# Altium schematic sheet DC075B_DTGC_CPLD.SchDoc: DTGC CPLD
size 558 x 431 mm; Date: Not shown in title block; ApprovedBy: Not shown in title block; CheckedBy: Not shown in title block; Author: Not shown in title block; CompanyName: Not shown in title block; DrawnBy: Praveen Aroul; Engineer: Not shown in title block; Organization: Not shown in title block; Address1: Not shown in title block; Address2: Not shown in title block; Address3: Not shown in title block; Address4: Not shown in title block; DocumentNumber: 9; Revision: Use project parameter SCH_Rev; SheetNumber: 9; SheetTotal: 13; PageSetup: Record=PageOptions|CenterHorizontal=True|CenterVertical=True|PrintScale=1.00|XCorrection=1.00|YCorrection=1.00|PrintKind=0|BorderSize=5000000|LeftOffset=0|BottomOffset=0|Orientation=2|PaperLength=1000|PaperWidth=1000|Scale=100|PaperSource=15|PrintQuality=600|MediaType=1|DitherType=10|PaperKind=Letter|PrintScaleMode=1; CurrentTime: Not shown in title block; CurrentDate: Not shown in title block; Time: Not shown in title block; DocumentFullPathAndName: Not shown in title block; DocumentName: Not shown in title block; ModifiedDate: Not shown in title block; ImagePath: Not shown in title block
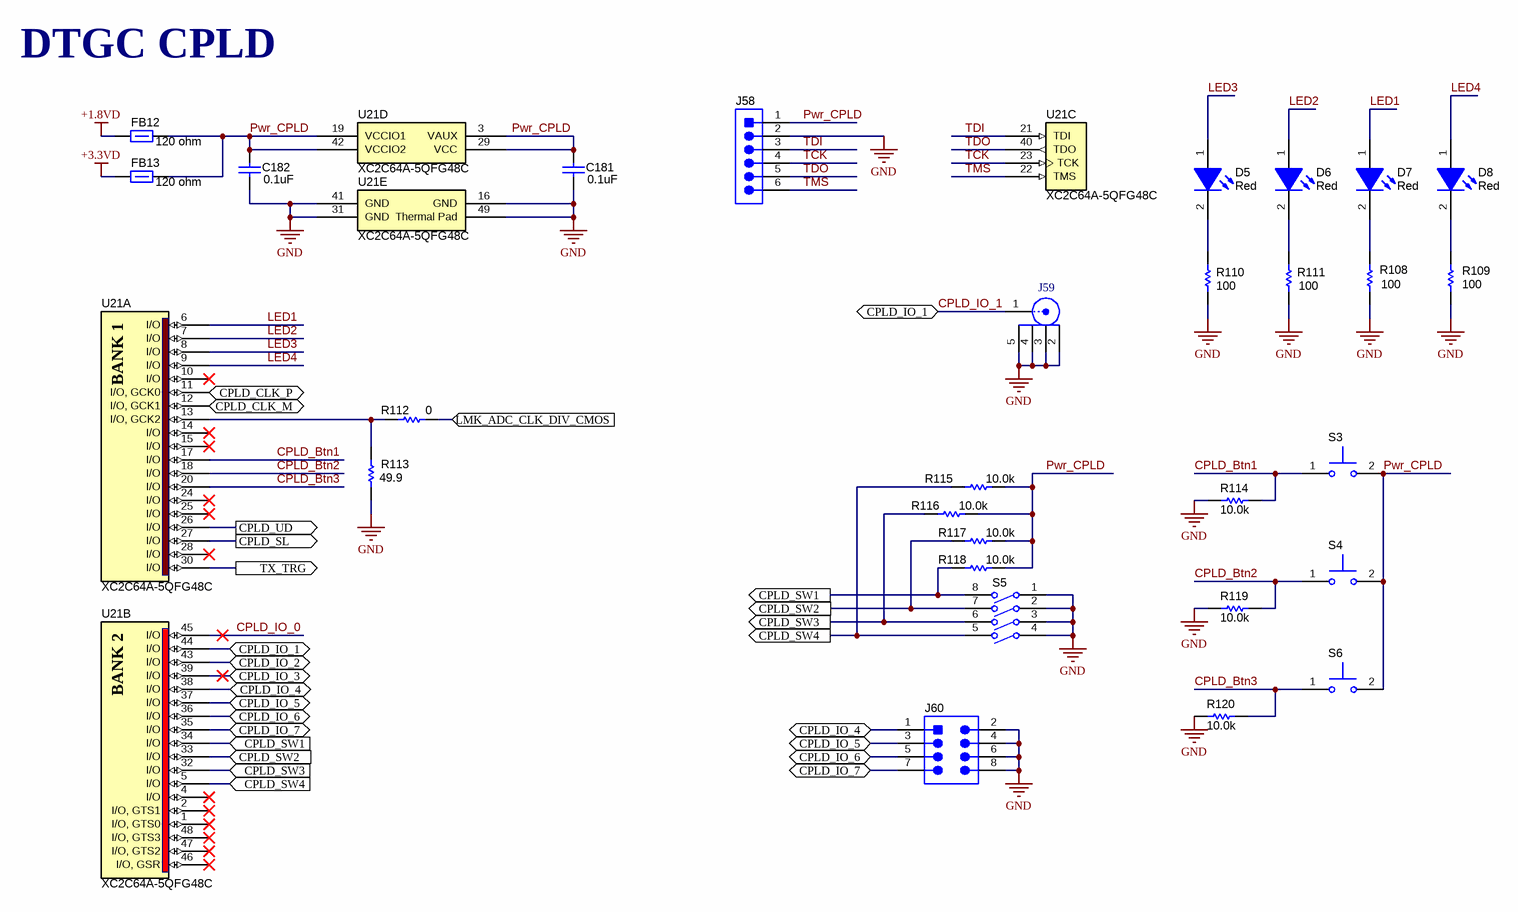
[diagram p0: DC075B_DTGC_CPLD.SchDoc]

## Parts
C181  value 0.1uF  [0603]  (hidden comment: CL10A104KA8NNNC)
C182  value 0.1uF  [0603]  (hidden comment: CL10A104KA8NNNC)
D5  value Red  [LED_LTST-C190_Red]  (hidden comment: LTST-C190CKT)
D6  value Red  [LED_LTST-C190_Red]  (hidden comment: LTST-C190CKT)
D7  value Red  [LED_LTST-C190_Red]  (hidden comment: LTST-C190CKT)
D8  value Red  [LED_LTST-C190_Red]  (hidden comment: LTST-C190CKT)
FB12  value 120 ohm  [0805]  (hidden comment: Ferrite_Bead)
FB13  value 120 ohm  [0805]  (hidden comment: Ferrite_Bead)
J58  Header_6x1  [TSW-106-07-G-S]  (value not drawn)
J59  5-1814832-1  [TE_5-1814832-1]  (value not drawn)
J60  Header_4x2  [TSW-104-07-G-D]  (value not drawn)
R108  ValueDisplayed: 100  [0402]  (hidden comment: Resistor)
R109  ValueDisplayed: 100  [0402]  (hidden comment: Resistor)
R110  ValueDisplayed: 100  [0402]  (hidden comment: Resistor)
R111  ValueDisplayed: 100  [0402]  (hidden comment: Resistor)
R112  value 0  [0402]  (hidden comment: Resistor)
R113  value 49.9  [0402]  (hidden comment: Resistor)
R114  value 10.0k  [0603]  (hidden comment: Resistor)
R115  value 10.0k  [0603]  (hidden comment: Resistor)
R116  value 10.0k  [0603]  (hidden comment: Resistor)
R117  value 10.0k  [0603]  (hidden comment: Resistor)
R118  value 10.0k  [0603]  (hidden comment: Resistor)
R119  value 10.0k  [0603]  (hidden comment: Resistor)
R120  value 10.0k  [0603]  (hidden comment: Resistor)
S3  SKRKAEE020  [SW_SKRKAE]  (value not drawn)
S4  SKRKAEE020  [SW_SKRKAE]  (value not drawn)
S5  SW_4SPST  [SW_1571983-5]  (value not drawn)
S6  SKRKAEE020  [SW_SKRKAE]  (value not drawn)
U21  XC2C64A-5QFG48C  [QFG48_N]  (parts A,B,C,D,E of 5)

## Ports
CPLD_CLK_M (out), CPLD_CLK_P (out), CPLD_IO_1, CPLD_IO_2, CPLD_IO_3, CPLD_IO_4 (bidir), CPLD_IO_5, CPLD_IO_6, CPLD_IO_7, CPLD_SL (out), CPLD_SW1 (in), CPLD_SW1 (out), CPLD_SW2 (in), CPLD_SW2 (out), CPLD_SW3 (in), CPLD_SW3 (out), CPLD_SW4 (in), CPLD_SW4 (out), CPLD_UD (out), LMK_ADC_CLK_DIV_CMOS (in), TX_TRG (out)

## Nets
+1.8VD: FB12.2
+3.3VD: FB13.2
GND: C181.2 C182.2 J58.2 J59.2 J59.3 J59.4 J59.5 J60.2 J60.4 J60.6 J60.8 R108.1 R109.1 R110.1 R111.1 R113.2 R114.2 R119.2 R120.2 S5.1(A1) S5.2(A2) S5.3(A3) S5.4(A4) U21.16(GND) U21.31(GND) U21.41(GND) U21.49(Thermal_Pad)
CPLD_Btn1: R114.1 S3.1 U21.17(I/O)
CPLD_Btn2: R119.1 S4.1 U21.18(I/O)
CPLD_Btn3: R120.1 S6.1 U21.20(I/O)
CPLD_CLK_M: U21.12(I/O,_GCK1) ; port CPLD_CLK_M
CPLD_CLK_P: U21.11(I/O,_GCK0) ; port CPLD_CLK_P
CPLD_IO_0: U21.45(I/O)
CPLD_IO_1: J59.1 U21.44(I/O) ; port CPLD_IO_1
CPLD_IO_2: U21.43(I/O) ; port CPLD_IO_2
CPLD_IO_3: U21.39(I/O) ; port CPLD_IO_3
CPLD_IO_4: J60.1 U21.38(I/O) ; port CPLD_IO_4
CPLD_IO_5: J60.3 U21.37(I/O) ; port CPLD_IO_5
CPLD_IO_6: J60.5 U21.36(I/O) ; port CPLD_IO_6
CPLD_IO_7: J60.7 U21.35(I/O) ; port CPLD_IO_7
CPLD_SL: U21.27(I/O) ; port CPLD_SL
CPLD_SW1: R118.1 S5.8(B1) U21.34(I/O) ; port CPLD_SW1
CPLD_SW2: R117.1 S5.7(B2) U21.33(I/O) ; port CPLD_SW2
CPLD_SW3: R116.1 S5.6(B3) U21.32(I/O) ; port CPLD_SW3
CPLD_SW4: R115.1 S5.5(B4) U21.5(I/O) ; port CPLD_SW4
CPLD_UD: U21.26(I/O) ; port CPLD_UD
LED1: D7.1(A) U21.6(I/O)
LED2: D6.1(A) U21.7(I/O)
LED3: D5.1(A) U21.8(I/O)
LED4: D8.1(A) U21.9(I/O)
LMK_ADC_CLK_DIV_CMOS: R112.1 ; port LMK_ADC_CLK_DIV_CMOS
Pwr_CPLD: C181.1 C182.1 FB12.1 FB13.1 J58.1 R115.2 R116.2 R117.2 R118.2 S3.2 S4.2 S6.2 U21.3(VAUX) U21.19(VCCIO1) U21.29(VCC) U21.42(VCCIO2)
TCK: J58.4 U21.23(TCK)
TDI: J58.3 U21.21(TDI)
TDO: J58.5 U21.40(TDO)
TMS: J58.6 U21.22(TMS)
TX_TRG: U21.30(I/O) ; port TX_TRG
NetD5_2: D5.2(K) R110.2
NetD6_2: D6.2(K) R111.2
NetD7_2: D7.2(K) R108.2
NetD8_2: D8.2(K) R109.2
NetR112_2: R112.2 R113.1 U21.13(I/O,_GCK2)

Not connected (* = marked no-connect by the designer): U21 1(I/O,_GTS0)* 2(I/O,_GTS1)* 4(I/O)* 10(I/O)* 14(I/O)* 15(I/O)* 24(I/O)* 25(I/O)* 28(I/O)* 46(I/O,_GSR)* 47(I/O,_GTS2)* 48(I/O,_GTS3)*

## Notes on the sheet
- DTGC CPLD
- Drawn By:
- SVN Rev:
- Number:
- TID #:
- Orderable:
- Rev:
- Sheet Title:
- File:
- Project Title:
- Designed for:
- Assembly Variant:
- Mod. Date:
- Sheet:
- Size:
- of
- C
- http://www.ti.com
- Texas Instruments and/or its licensors do not warrant the accuracy or completeness of this specification or any information contained therein. Texas Instruments and/or its licensors do not warrant that this design will meet the specifications, will be suitable for your application or fit for any particular purpose, or will operate in an implementation. Texas Instruments and/or its licensors do not warrant that the design is production worthy. You should completely validate and test your design implementation to confirm the system functionality for your application.
- Engineer:
- Contact:
- © Texas Instruments
- (in symbol CMP-0005395-2, part A) BANK 1
- (in symbol CMP-0005395-2, part B) BANK 2

## Library data of the parts
C181 C182 = CMP-0085577-2: CAP, CERM, 0.1 µF, 25 V,+/- 10%, X5R, 0603; Manufacturer: Samsung Electro-Mechanics; Polarized: N; ValueDisplayed: 0.1µF; U/M: EA; Cap_F: 100nF; VDC_V: 25V; TaMin_C: -55°C; TaMax_C: 85°C; AEC Category: Q200; SizeArea_mm2: 1.28; SizeAreaWB_mm2: 4.68; SizeX_mm: 1.6; SizeY_mm: 0.8; SizeZ_mm: 1; Green_REACh: Incomplete; Green_Lifecycle: Active; CompType: Capacitor; PartNumber: CL10A104KA8NNNC; PackageReference: 0603; RoHS: Y; Tolerance_%: 10%; Value2: 25V; MountType: SMT; Technology: Ceramic; TempCo: X5R; Cap_Case: 0603; ComponentLink1Description: Datasheet link; ComponentLink1URL: http://www.samsungsem.com/kr/support/product-search/mlcc/__icsFiles/afieldfile/2018/06/20/CL10A104KA8NNNC.pdf; AEC Grade: N/A; AEC Qualified: N; Green_EU RoHS: Passed; Green_EU RoHS-2: Incomplete
D5-D8 = CMP-0002842-2: LED, Red, SMD; Manufacturer: Lite-On; Vf_V: 2V; Io_A: 20mA; Tjmax_C: 85°C; Power_TotalModule: 62.5mW; Value1: 0.0625W; CompType: LED; MountType: SMT; ComponentLink1URL: http://optoelectronics.liteon.com/en-us/api/DwonloadFileHandler.ashx?txtSpecNo=DS-22-98-0009&txtPartNo=LTST-C190CKT; ComponentLink1Description: Datasheet link; PackageReference: Red LED, 1.6x0.8x0.8mm; PartNumber: LTST-C190CKT; RoHS: Y; Type: ?; Value2: 2V; Color: red
FB12 FB13 = CMP-0003358-1: Ferrite Bead, 120 ohm @ 100 MHz, 0.8 A, 0805; Manufacturer: MuRata; PartNumber: BLM21AG121SN1D; Imax_A: 8dA; DCR_ohm: 1d; Value1: 0.1 ohm; Value2: 0.8A; ZTyp@100MHz_Ohm: 120; SizeArea_mm2: 2.5; SizeAreaWB_mm2: 6.75; SizeX_mm: 2; SizeY_mm: 1.25; SizeZ_mm: 1.45; ComponentLink1Description: Datasheet link; ComponentLink1URL: http://search.murata.co.jp/Ceramy/image/img/PDF/ENG/L0110S0100BLM21A.pdf; CompType: Ferrite Bead; MountType: SMT; PackageReference: 0805; RoHS: Y; Published: 2014-04-30; Publisher: Texas Instruments; LatestRevisionDate: 2017-03-09; Supplier 1: Digi-Key; Supplier Part Number 1: 490-1038-1-ND; Supplier 2: Newark; Supplier Part Number 2: 73M9128; Supplier 3: Mouser; Supplier Part Number 3: 81-BLM21AG121SN1D; ValueDisplayed: 120 ohm
J58 = CMP-0075413-2: Header, 100mil, 6x1, Gold, TH; Manufacturer: Samtec; Cert_CSA: Y; Cert_CULUS: N; Current_A: 6.3A; Gender: Male; Green_Lifecycle: Active; Green_REACh: Passed; Pitch_mm: 2.54; Row_Count: 1; Voltage_V: 550V; PartNumber: TSW-106-07-G-S; PackageReference: 6x1 Header; ClassName: Header; CompType: Header; RoHS: Y; MountType: TH; ComponentLink1Description: Datasheet URL; ComponentLink1URL: http://samtec.com/ftppub/pdf/TSW_TH.PDF; Supplier 1: Digi-Key; Supplier Part Number 1: SAM1029-06-ND; Cert_UL: Y; Cert_VDE: N; Color: Black; ContactFinish: Gold; Green_EU RoHS-2: Passed; Green_EU RoHS: Passed; Orientation: Vertical; PinCount: 6; Shrouded: N
J59 = CMP-0054990-1: SMA Straight PCB Socket Die Cast, 50 Ohm, TH; Manufacturer: TE Connectivity; Green_Lifecycle: Active; Green_REACh: Passed; CNHeader: FALSE; CT: TRUE; PartNumber: 5-1814832-1; PackageReference: SMA Straight PCB Socket Die Cast, TH; CompType: SMA; RoHS: Y; MountType: TH; ComponentLink1Description: Datasheet URL; ComponentLink1URL: http://www.te.com/commerce/DocumentDelivery/DDEController?Action=srchrtrv&DocNm=1814832&DocType=Customer+Drawing&DocLang=English; Supplier 1: Digi-Key; Supplier Part Number 1: A97594-ND; Supplier 2: Newark; Supplier Part Number 2: 78M7270; Supplier 3: Mouser; Supplier Part Number 3: 571-5-1814832-1; Green_EU RoHS-2: Incomplete; Green_EU RoHS: Passed with Exemption; Publisher: Texas Instruments; LatestRevisionDate: 26/05/2017
J60 = CMP-0075408-2: Header, 100mil, 4x2, Gold, TH; Manufacturer: Samtec; Cert_CSA: Y; Cert_CULUS: N; Current_A: 6.3A; Gender: Male; Green_Lifecycle: Active; Green_REACh: Passed; Pitch_mm: 2.54; Row_Count: 2; Voltage_V: 550V; PartNumber: TSW-104-07-G-D; PackageReference: 4x2 Header; ClassName: Header; CompType: Header; RoHS: Y; MountType: TH; ComponentLink1Description: Datasheet URL; ComponentLink1URL: http://samtec.com/ftppub/pdf/TSW_TH.PDF; Supplier 1: Digi-Key; Supplier Part Number 1: SAM1028-04-ND; Cert_UL: Y; Cert_VDE: N; Color: Black; ContactFinish: Gold; Green_EU RoHS-2: Passed; Green_EU RoHS: Passed; Orientation: Vertical; PinCount: 8; RowSpacing_mm: 2.54; Shrouded: N
R108-R111 = CMP-0026656-1: RES, 100, 1%, 0.1 W, 0402; Manufacturer: Panasonic; PartNumber: ERJ-2RKF1000X; Value: 100; Value_Code: 100R; Power_W: 100mW; Value2: 0.1W; VDC_V: 50V; TempCo: 100 ppm/C; EIA_Code: E96; U/M: EA; AEC Category: Q200; SizeArea_mm2: 0.5; SizeX_mm: 1; SizeZ_mm: 0.6; ComponentLink1Description: Datasheet link; ComponentLink1URL: http://industrial.panasonic.com/www-data/pdf/AOA0000/AOA0000CE2.pdf; CompType: Resistor; MountType: SMT; PackageReference: 0402; RoHS: Y; Res_ohm: 100; Tolerance_%: 1%; Value1: 1%; Technology: Thick Film; Published: 2008-06-26; Publisher: Texas Instruments; LatestRevisionDate: 2017-03-09; Supplier 1: Digi-Key; Supplier Part Number 1: P100LCT-ND; Supplier 2: Newark; Supplier Part Number 2: 64R5246; Supplier 3: Mouser; Supplier Part Number 3: 667-ERJ-2RKF1000X; AEC Qualified: ?; SizeY_mm: 0.5
R112 = CMP-0026822-3: RES, 0, 5%, 0.063 W, AEC-Q200 Grade 0, 0402; Manufacturer: Vishay-Dale; PartNumber: CRCW04020000Z0ED; Value_Code: 0000; Power_W: 63mW; Value2: 0.063W; VDC_V: 50V; TempCo: 200 ppm/C; EIA_Code: E24; AEC Category: Q200; AEC Qualified: Y; SizeArea_mm2: 0.5; SizeX_mm: 1; SizeZ_mm: 0.6; ComponentLink1Description: Datasheet link; ComponentLink1URL: http://www.vishay.com/docs/20035/dcrcwe3.pdf; CompType: Resistor; MountType: SMT; PackageReference: 0402; RoHS: E; ValueDisplayed: 0; Res_ohm: 0; Tolerance_%: 5%; Value1: 5%; Technology: Thick Film; Supplier 1: Digi-Key; Supplier Part Number 1: 541-0.0JCT-ND; Supplier 2: Newark; Supplier Part Number 2: 52K6543; Supplier 3: Mouser; Supplier Part Number 3: 71-CRCW0402-0-E3; AEC Grade: 0; SizeY_mm: 0.5
R113 = CMP-0026404-2: RES, 49.9, 1%, 0.063 W, AEC-Q200 Grade 0, 0402; Manufacturer: Vishay-Dale; PartNumber: CRCW040249R9FKED; Value_Code: 49R9; Power_W: 63mW; Value2: 0.063W; VDC_V: 50V; TempCo: 100 ppm/C; EIA_Code: E96; AEC Category: Q200; AEC Grade: 0; AEC Qualified: Y; SizeArea_mm2: 0.5; SizeX_mm: 1; SizeZ_mm: 0.6; ComponentLink1Description: Datasheet link; ComponentLink1URL: http://www.vishay.com/docs/20035/dcrcwe3.pdf; CompType: Resistor; MountType: SMT; PackageReference: 0402; RoHS: E; ValueDisplayed: 49.9; Res_ohm: 49.9; Tolerance_%: 1%; Value1: 1%; Technology: Thick Film; Supplier 1: Digi-Key; Supplier Part Number 1: 541-49.9LCT-ND; Supplier 2: Newark; Supplier Part Number 2: 52K7114; Supplier 3: Mouser; Supplier Part Number 3: 71-CRCW0402-49.9-E3; SizeY_mm: 0.5
R114-R120 = CMP-0022684-3: RES, 10.0 k, 1%, 0.1 W, 0603; Manufacturer: Panasonic; PartNumber: ERJ-3EKF1002V; Res_ohm: 10k; Value_Code: 10k0; Power_W: 100mW; Value2: 0.1W; VDC_V: 75V; TempCo: 100 ppm/C; EIA_Code: E96; U/M: EA; AEC Category: Q200; SizeArea_mm2: 1.28; SizeX_mm: 1.6; SizeY_mm: 0.8; SizeZ_mm: 1; ComponentLink1Description: Datasheet link; ComponentLink1URL: http://industrial.panasonic.com/www-data/pdf/AOA0000/AOA0000CE2.pdf; CompType: Resistor; MountType: SMT; PackageReference: 0603; RoHS: Y; ValueDisplayed: 10.0k; Tolerance_%: 1%; Value1: 1%; Technology: Thick Film; Published: 2008-06-26; Publisher: Texas Instruments; LatestRevisionDate: 2017-03-09; Supplier 1: Digi-Key; Supplier Part Number 1: P10.0KHCT-ND; Supplier 2: Newark; Supplier Part Number 2: 64R5309; Supplier 3: Mouser; Supplier Part Number 3: 667-ERJ-3EKF1002V; AEC Qualified: ?
S3 S4 S6 = CMP-0085606-1: Switch, SPST-NO, 0.05 A, 12 VDC, SMT; Manufacturer: Alps; VDC_V: 12V; PositionCount: 1; CurrentRating_mA: 50A; SizeArea_mm2: 13.92; SizeAreaWB_mm2: 22.62; SizeX_mm: 4.8; SizeY_mm: 2.9; SizeZ_mm: 2.2; PartNumber: SKRKAEE020; MountType: SMT; ComponentLink1Description: Datasheet URL; ComponentLink1URL: https://www.alps.com/prod/info/E/HTML/Tact/SurfaceMount/SKRK/SKRKAEE020.html; RoHS: Y; Circuit: SPST-NO; Orientation: Top Actuated; CompType: Switch; PackageReference: 3.9x2.9mm; Publisher: Texas Instruments; LatestRevisionDate: 2018-11-05
S5 = CMP-0002184-2: Switch, SPST, 4 Pos, Top Actuated, SMD; PartNumber: 1571983-5; Manufacturer: TE Connectivity; VDC_V: 24V; PositionCount: 4; CurrentRating_mA: 25A; MountType: SMT; ComponentLink1Description: Datasheet URL; ComponentLink1URL: http://www.te.com/commerce/DocumentDelivery/DDEController?Action=srchrtrv&DocNm=1571983&DocType=Customer+Drawing&DocLang=English; RoHS: Y; CompType: Switch; PackageReference: SMD, 8-Leads, Pitch 1.27mm; Circuit: SPST; Orientation: Top Actuated; Publisher: Texas Instruments; LatestRevisionDate: 2017-03-09; Supplier 1: Digi-Key; Supplier Part Number 1: 450-1762-1-ND; Supplier 2: Newark; Supplier Part Number 2: 74T0481; Supplier 3: Mouser; Supplier Part Number 3: 506-GDH04STR04
U21 = CMP-0005395-2: XC2C64A CoolRunner-II CPLD, QFG48; Manufacturer: Xilinx; PartNumber: XC2C64A-5QFG48C; MountType: SMT; ComponentLink1Description: Datasheet URL; ComponentLink1URL: http://www.xilinx.com/support/documentation/data_sheets/ds311.pdf; RoHS: Y; PackageReference: QFN-48; Publisher: Texas Instruments; LatestRevisionDate: 09/03/2017; Supplier 1: Digi-Key; Supplier Part Number 1: 122-1419-ND